# EAGLE schematic C10450-01 (EAGLE 6.6.0)
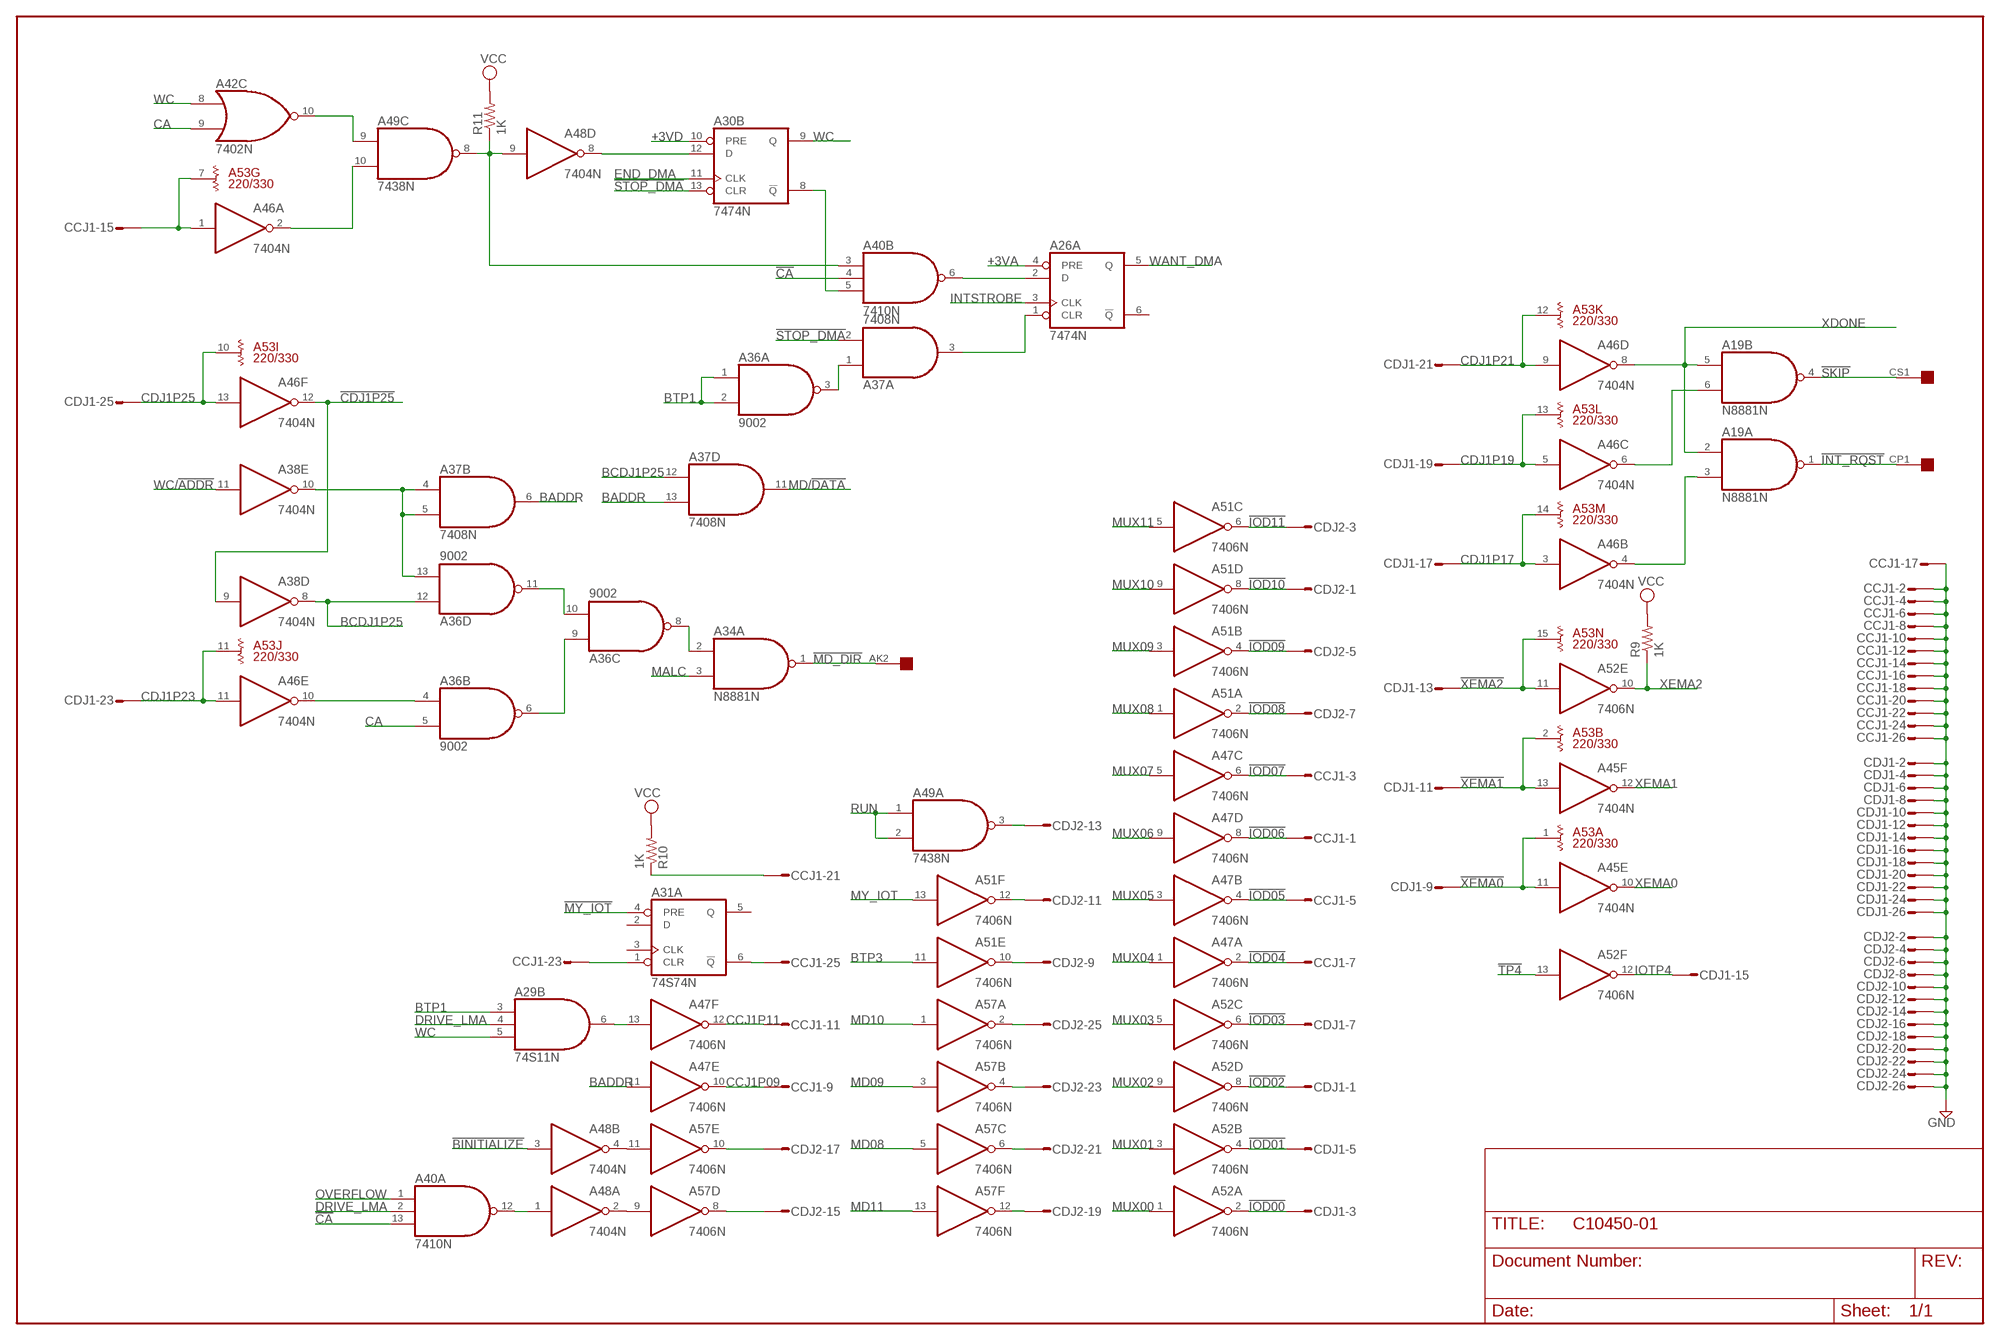
[diagram p0: schematic, sheet 1, part 1 of 3]
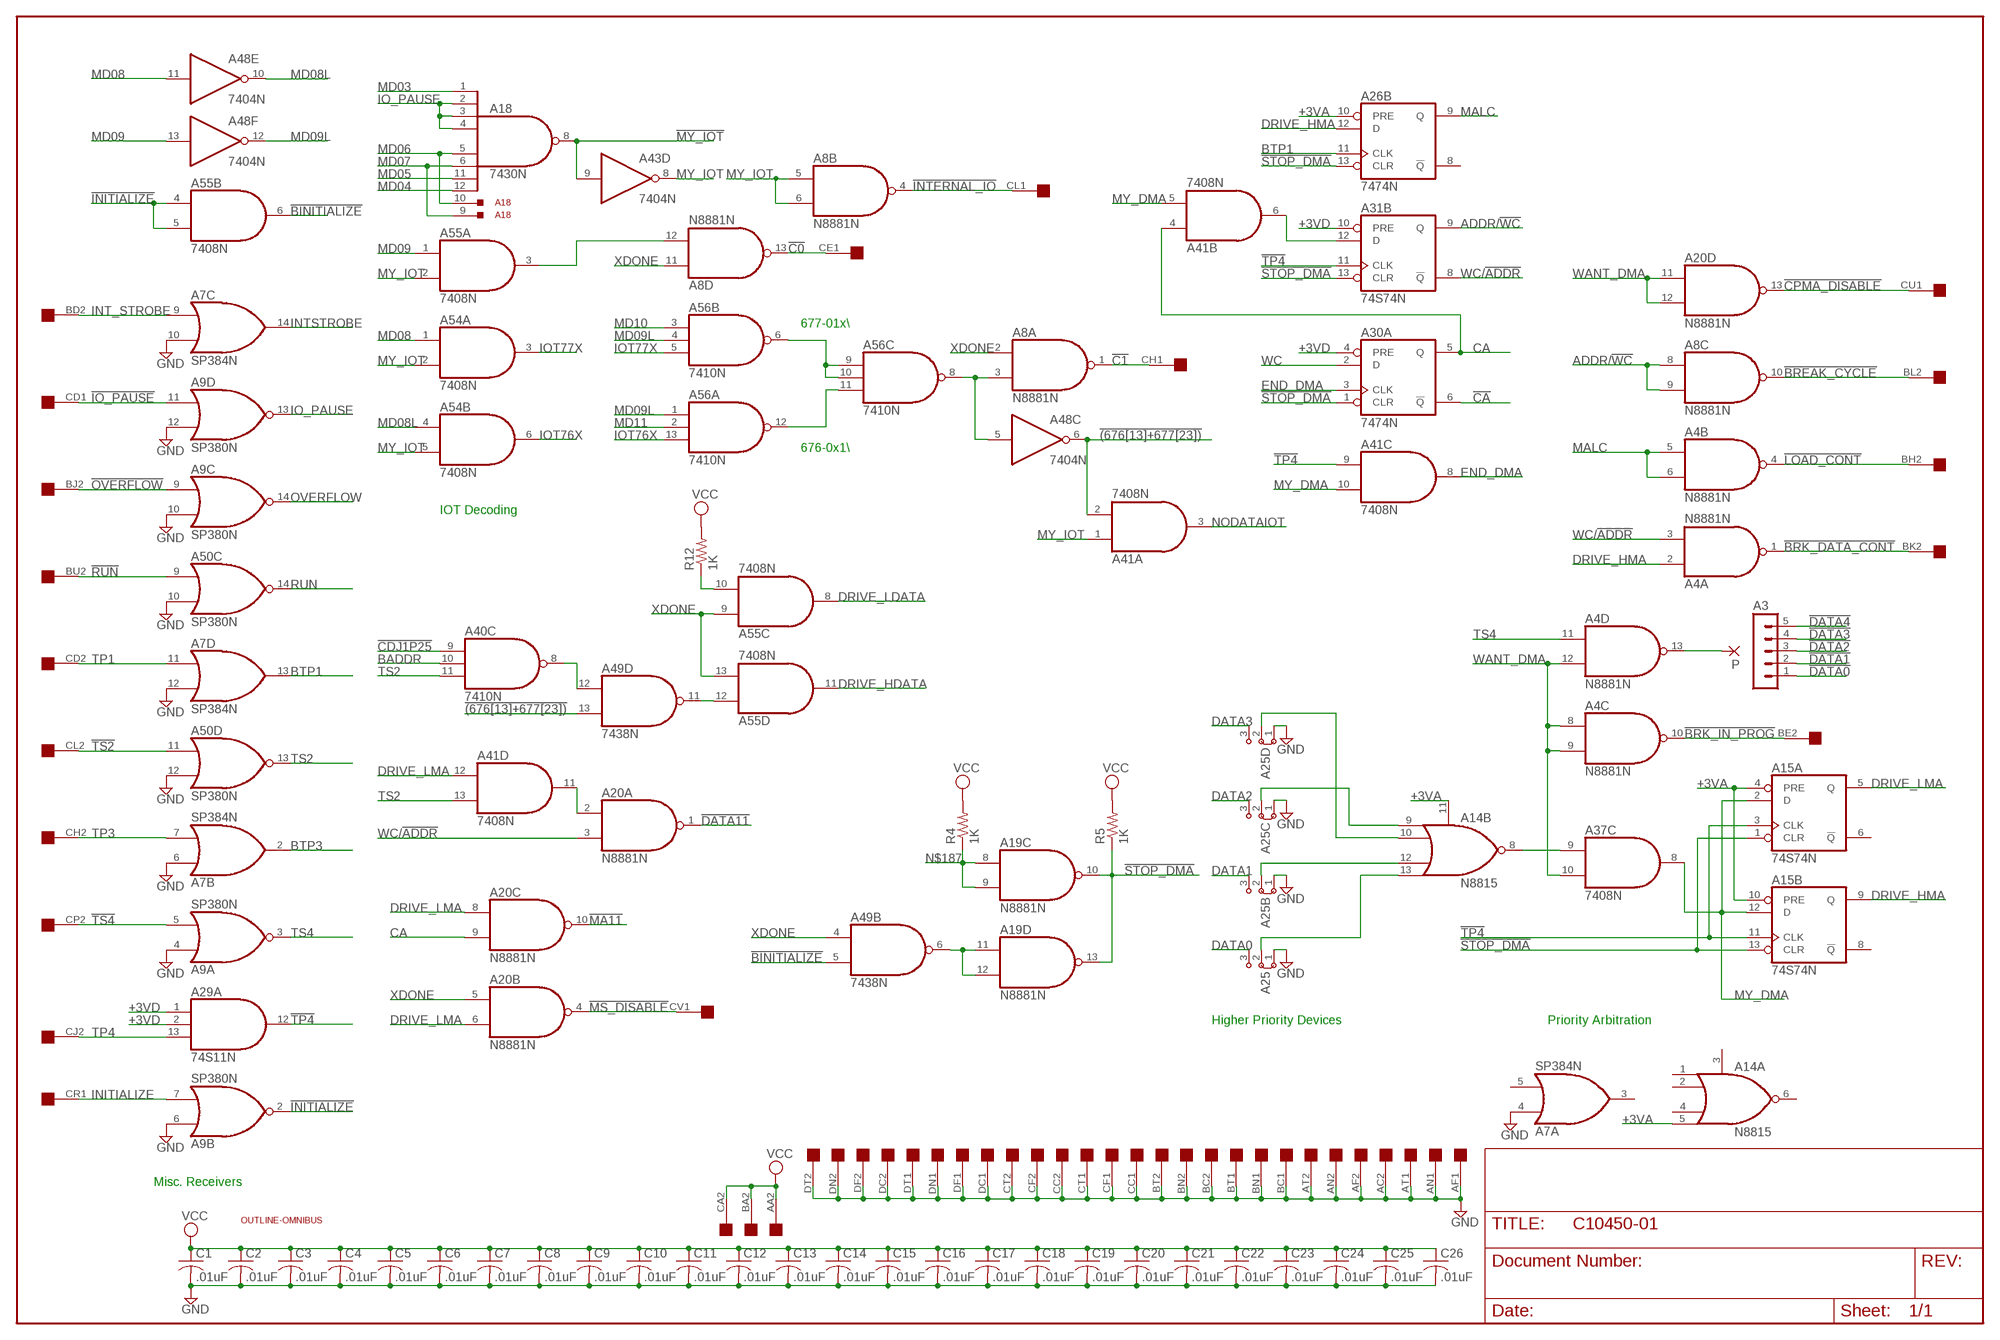
[diagram p1: schematic, sheet 1, part 2 of 3]
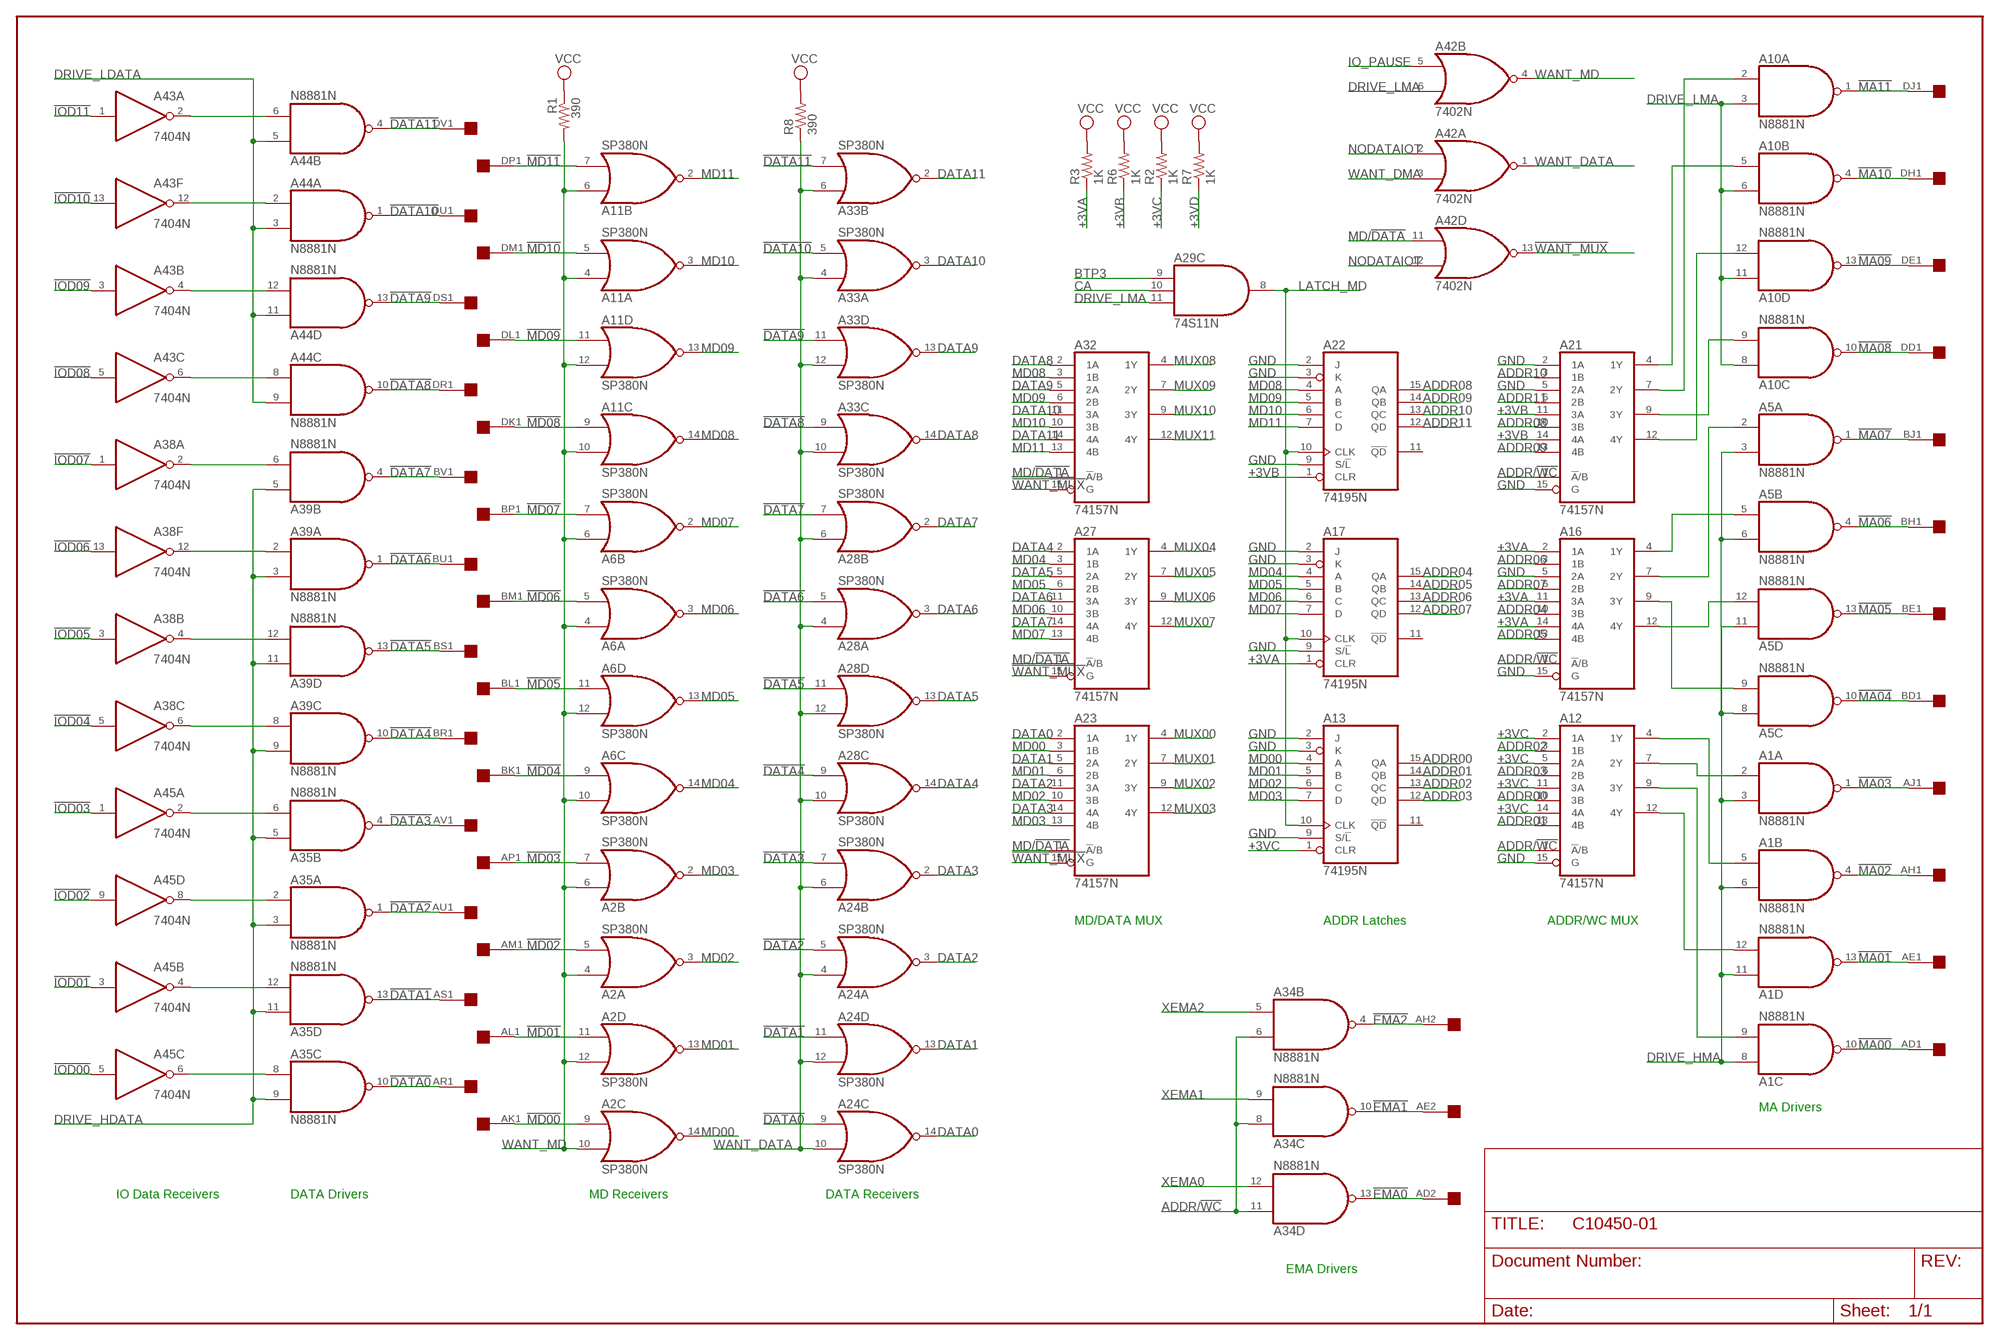
[diagram p2: schematic, sheet 1, part 3 of 3]

## Parts
A1  N8881N  [DIL14]
A2  SP380N  [DIL14]
A3  MA05-1  [MA05-1]
A4  N8881N  [DIL14]
A5  N8881N  [DIL14]
A6  SP380N  [DIL14]
A7  SP384N  [DIL14]
A8  N8881N  [DIL14]
A9  SP380N  [DIL14]
A10  N8881N  [DIL14]
A11  SP380N  [DIL14]
A12  74157N  [DIL16]
A13  74195N  74S195N  [DIL16]
A14  N8815  7425N  [DIL14]
A15  74S74N  [DIL14]
A16  74157N  [DIL16]
A17  74195N  74S195N  [DIL16]
A18  7430N  [DIL14]
A19  N8881N  [DIL14]
A20  N8881N  [DIL14]
A21  74157N  [DIL16]
A22  74195N  74S195N  [DIL16]
A23  74157N  [DIL16]
A24  SP380N  [DIL14]
A25  J2X5MM  [05C]
A25B  J2X5MM  [05C]
A25C  J2X5MM  [05C]
A25D  J2X5MM  [05C]
A26  7474N  74S74N  [DIL14]
A27  74157N  [DIL16]
A28  SP380N  [DIL14]
A29  74S11N  [DIL14]
A30  7474N  74S74N  [DIL14]
A31  74S74N  [DIL14]
A32  74157N  [DIL16]
A33  SP380N  [DIL14]
A34  N8881N  [DIL14]
A35  N8881N  [DIL14]
A36  9002  7400N  [DIL14]
A37  7408N  74LS08N  [DIL14]
A38  7404N  [DIL14]
A39  N8881N  [DIL14]
A40  7410N  [DIL14]
A41  7408N  74LS08N  [DIL14]
A42  7402N  [DIL14]
A43  7404N  [DIL14]
A44  N8881N  [DIL14]
A45  7404N  [DIL14]
A46  7404N  [DIL14]
A47  7406N  [DIL14]
A48  7404N  [DIL14]
A49  7438N  [DIL14]
A50  SP380N  [DIL14]
A51  7406N  [DIL14]
A52  7406N  [DIL14]
A53  220/330  [DIL16]
A54  7408N  74LS08N  [DIL14]
A55  7408N  74LS08N  [DIL14]
A56  7410N  [DIL14]
A57  7406N  [DIL14]
C1  .01uF  C-US050-025X075  [C050-025X075]
C2  .01uF  C-US050-025X075  [C050-025X075]
C3  .01uF  C-US050-025X075  [C050-025X075]
C4  .01uF  C-US050-025X075  [C050-025X075]
C5  .01uF  C-US050-025X075  [C050-025X075]
C6  .01uF  C-US050-025X075  [C050-025X075]
C7  .01uF  C-US050-025X075  [C050-025X075]
C8  .01uF  C-US050-025X075  [C050-025X075]
C9  .01uF  C-US050-025X075  [C050-025X075]
C10  .01uF  C-US050-025X075  [C050-025X075]
C11  .01uF  C-US050-025X075  [C050-025X075]
C12  .01uF  C-US050-025X075  [C050-025X075]
C13  .01uF  C-US050-025X075  [C050-025X075]
C14  .01uF  C-US050-025X075  [C050-025X075]
C15  .01uF  C-US050-025X075  [C050-025X075]
C16  .01uF  C-US050-025X075  [C050-025X075]
C17  .01uF  C-US050-025X075  [C050-025X075]
C18  .01uF  C-US050-025X075  [C050-025X075]
C19  .01uF  C-US050-025X075  [C050-025X075]
C20  .01uF  C-US050-025X075  [C050-025X075]
C21  .01uF  C-US050-025X075  [C050-025X075]
C22  .01uF  C-US050-025X075  [C050-025X075]
C23  .01uF  C-US050-025X075  [C050-025X075]
C24  .01uF  C-US050-025X075  [C050-025X075]
C25  .01uF  C-US050-025X075  [C050-025X075]
C26  .01uF  C-US050-025X075  [C050-025X075]
CCJ1  26HS  [26H]
CDJ1  26HS  [26H]
CDJ2  26HS  [26H]
P  1,6/0,8  [1,6/0,8]
R1  390  R-US_0207/10  [0207/10]
R2  1K  R-US_0207/10  [0207/10]
R3  1K  R-US_0207/10  [0207/10]
R4  1K  R-US_0207/10  [0207/10]
R5  1K  R-US_0207/10  [0207/10]
R6  1K  R-US_0207/10  [0207/10]
R7  1K  R-US_0207/10  [0207/10]
R8  390  R-US_0207/10  [0207/10]
R9  1K  R-US_0207/10  [0207/10]
R10  1K  R-US_0207/10  [0207/10]
R11  1K  R-US_0207/10  [0207/10]
R12  1K  R-US_0207/10  [0207/10]
U$1  OUTLINE-OMNIBUS  [OMNIBUS]
U$2  QUAD  [EDGE-CON8]

## Nets
!(676[13]+677[23]): A41.2(A:I1) A48.6(C:O) A49.13(D:I1)
!BINITIALIZE: A48.3(B:I) A49.5(B:I1) A55.6(B:O)
!BREAK_CYCLE: A8.10(C:O) U$2.BL2
!BRK_DATA_CONT: A4.1(A:O) U$2.BK2
!BRK_IN_PROG: A4.10(C:O) U$2.BE2
!C0: A8.13(D:O) U$2.CE1
!C1: A8.1(A:O) U$2.CH1
!CA: A30.6(A:!Q) A40.4(B:I1) A40.13(A:I2)
!CDJ1P25: A38.9(D:I) A40.9(C:I0) A46.12(F:O)
!CPMA_DISABLE: A20.13(D:O) U$2.CU1
!DATA0: A3.1 A24.9(C:I0) A35.10(C:O) U$2.AR1
!DATA1: A3.2 A24.11(D:I0) A35.13(D:O) U$2.AS1
!DATA2: A3.3 A24.5(A:I1) A35.1(A:O) U$2.AU1
!DATA3: A3.4 A24.7(B:I1) A35.4(B:O) U$2.AV1
!DATA4: A3.5 A28.9(C:I0) A39.10(C:O) U$2.BR1
!DATA5: A28.11(D:I0) A39.13(D:O) U$2.BS1
!DATA6: A28.5(A:I1) A39.1(A:O) U$2.BU1
!DATA7: A28.7(B:I1) A39.4(B:O) U$2.BV1
!DATA8: A33.9(C:I0) A44.10(C:O) U$2.DR1
!DATA9: A33.11(D:I0) A44.13(D:O) U$2.DS1
!DATA10: A33.5(A:I1) A44.1(A:O) U$2.DU1
!DATA11: A20.1(A:O) A33.7(B:I1) A44.4(B:O) U$2.DV1
!EMA0: A34.13(D:O) U$2.AD2
!EMA1: A34.10(C:O) U$2.AE2
!EMA2: A34.4(B:O) U$2.AH2
!INITIALIZE: A9.2(B:O) A55.4(B:I0) A55.5(B:I1)
!INT_RQST: A19.1(A:O) U$2.CP1
!INTERNAL_IO: A8.4(B:O) U$2.CL1
!IO_PAUSE: A9.11(D:I0) U$2.CD1
!IOD00: A45.5(C:I) A52.2(A:O) CDJ1.3
!IOD01: A45.3(B:I) A52.4(B:O) CDJ1.5
!IOD02: A45.9(D:I) A52.8(D:O) CDJ1.1
!IOD03: A45.1(A:I) A52.6(C:O) CDJ1.7
!IOD04: A38.5(C:I) A47.2(A:O) CCJ1.7
!IOD05: A38.3(B:I) A47.4(B:O) CCJ1.5
!IOD06: A38.13(F:I) A47.8(D:O) CCJ1.1
!IOD07: A38.1(A:I) A47.6(C:O) CCJ1.3
!IOD08: A43.5(C:I) A51.2(A:O) CDJ2.7
!IOD09: A43.3(B:I) A51.4(B:O) CDJ2.5
!IOD10: A43.13(F:I) A51.8(D:O) CDJ2.1
!IOD11: A43.1(A:I) A51.6(C:O) CDJ2.3
!LOAD_CONT: A4.4(B:O) U$2.BH2
!MA00: A1.10(C:O) U$2.AD1
!MA01: A1.13(D:O) U$2.AE1
!MA02: A1.4(B:O) U$2.AH1
!MA03: A1.1(A:O) U$2.AJ1
!MA04: A5.10(C:O) U$2.BD1
!MA05: A5.13(D:O) U$2.BE1
!MA06: A5.4(B:O) U$2.BH1
!MA07: A5.1(A:O) U$2.BJ1
!MA08: A10.10(C:O) U$2.DD1
!MA09: A10.13(D:O) U$2.DE1
!MA10: A10.4(B:O) U$2.DH1
!MA11: A10.1(A:O) A20.10(C:O) U$2.DJ1
!MD00: A2.9(C:I0) U$2.AK1
!MD01: A2.11(D:I0) U$2.AL1
!MD02: A2.5(A:I1) U$2.AM1
!MD03: A2.7(B:I1) U$2.AP1
!MD04: A6.9(C:I0) U$2.BK1
!MD05: A6.11(D:I0) U$2.BL1
!MD06: A6.5(A:I1) U$2.BM1
!MD07: A6.7(B:I1) U$2.BP1
!MD08: A11.9(C:I0) U$2.DK1
!MD09: A11.11(D:I0) U$2.DL1
!MD10: A11.5(A:I1) U$2.DM1
!MD11: A11.7(B:I1) U$2.DP1
!MD_DIR: A34.1(A:O) U$2.AK2
!MS_DISABLE: A20.4(B:O) U$2.CV1
!MY_IOT: A18.8(O) A31.4(A:PRE) A43.9(D:I)
!OVERFLOW: A9.9(C:I0) U$2.BJ2
!RUN: A50.9(C:I0) U$2.BU2
!SKIP: A19.4(B:O) U$2.CS1
!STOP_DMA: A15.1(A:CLR) A15.13(B:CLR) A19.10(C:O) A19.13(D:O) A26.13(B:CLR) A30.1(A:CLR) A30.13(B:CLR) A31.13(B:CLR) A37.2(A:I1) R5.1
!TP4: A15.3(A:CLK) A15.11(B:CLK) A29.12(A:O) A31.11(B:CLK) A41.9(C:I0) A52.13(F:I)
!TS2: A50.11(D:I0) U$2.CL2
!TS4: A9.5(A:I1) U$2.CP2
!WANT_MUX: A23.15(G) A27.15(G) A32.15(G) A42.13(D:O)
!WC: A30.8(B:!Q) A40.5(B:I2)
!XEMA0: A45.11(E:I) A53.1(A:TERM) CDJ1.9
!XEMA1: A45.13(F:I) A53.2(B:TERM) CDJ1.11
!XEMA2: A52.11(E:I) A53.15(N:TERM) CDJ1.13
+3VA: A14.5(A:I3) A14.11(B:G) A15.4(A:PRE) A15.10(B:PRE) A16.2(1A) A16.11(3A) A16.14(4A) A17.1(CLR) A26.4(A:PRE) A26.10(B:PRE) R3.1
+3VB: A21.11(3A) A21.14(4A) A22.1(CLR) R6.1
+3VC: A12.2(1A) A12.5(2A) A12.11(3A) A12.14(4A) A13.1(CLR) R2.1
+3VD: A29.1(A:I0) A29.2(A:I1) A30.4(A:PRE) A30.10(B:PRE) A31.10(B:PRE) R7.1
ADDR00: A12.10(3B) A13.15(QA)
ADDR01: A12.13(4B) A13.14(QB)
ADDR02: A12.3(1B) A13.13(QC)
ADDR03: A12.6(2B) A13.12(QD)
ADDR04: A16.10(3B) A17.15(QA)
ADDR05: A16.13(4B) A17.14(QB)
ADDR06: A16.3(1B) A17.13(QC)
ADDR07: A16.6(2B) A17.12(QD)
ADDR08: A21.10(3B) A22.15(QA)
ADDR09: A21.13(4B) A22.14(QB)
ADDR10: A21.3(1B) A22.13(QC)
ADDR11: A21.6(2B) A22.12(QD)
ADDR/!WC: A8.8(C:I0) A8.9(C:I1) A12.1(!A!/B) A16.1(!A!/B) A21.1(!A!/B) A31.9(B:Q) A34.6(B:I1) A34.8(C:I0) A34.11(D:I0)
BADDR: A37.6(B:O) A37.13(D:I1) A40.10(C:I1) A47.11(E:I)
BCDJ1P25: A36.12(D:I0) A37.12(D:I0) A38.8(D:O)
BTP1: A7.13(D:O) A26.11(B:CLK) A29.3(B:I0) A36.1(A:I0) A36.2(A:I1)
BTP3: A7.2(B:O) A29.9(C:I0) A51.11(E:I)
CA: A20.9(C:I1) A29.10(C:I1) A30.5(A:Q) A36.5(B:I1) A41.4(B:I0) A42.9(C:I1)
CCJ1P09: A47.10(E:O) CCJ1.9
CCJ1P11: A47.12(F:O) CCJ1.11
CDJ1P17: A46.3(B:I) A53.14(M:TERM) CDJ1.17
CDJ1P19: A46.5(C:I) A53.13(L:TERM) CDJ1.19
CDJ1P21: A46.9(D:I) A53.12(K:TERM) CDJ1.21
CDJ1P23: A46.11(E:I) A53.11(J:TERM) CDJ1.23
CDJ1P25: A46.13(F:I) A53.10(I:TERM) CDJ1.25
CDJ2P09: A51.10(E:O) CDJ2.9
CDJ2P11: A51.12(F:O) CDJ2.11
CDJ2P13: A49.3(A:O) CDJ2.13
CDJ2P15: A57.8(D:O) CDJ2.15
CDJ2P17: A57.10(E:O) CDJ2.17
CDJ2P19: A57.12(F:O) CDJ2.19
CDJ2P21: A57.6(C:O) CDJ2.21
CDJ2P23: A57.4(B:O) CDJ2.23
CDJ2P25: A57.2(A:O) CDJ2.25
DATA0: A23.2(1A) A24.14(C:O) A25.3
DATA1: A23.5(2A) A24.13(D:O) A25B.3
DATA2: A23.11(3A) A24.3(A:O) A25C.3
DATA3: A23.14(4A) A24.2(B:O) A25D.3
DATA4: A27.2(1A) A28.14(C:O)
DATA5: A27.5(2A) A28.13(D:O)
DATA6: A27.11(3A) A28.3(A:O)
DATA7: A27.14(4A) A28.2(B:O)
DATA8: A32.2(1A) A33.14(C:O)
DATA9: A32.5(2A) A33.13(D:O)
DATA10: A32.11(3A) A33.3(A:O)
DATA11: A32.14(4A) A33.2(B:O)
DRIVE_HDATA: A35.3(A:I1) A35.5(B:I0) A35.9(C:I1) A35.11(D:I0) A39.3(A:I1) A39.5(B:I0) A39.9(C:I1) A39.11(D:I0) A55.11(D:O)
DRIVE_HMA: A1.3(A:I1) A1.6(B:I1) A1.8(C:I0) A1.11(D:I0) A4.2(A:I0) A5.3(A:I1) A5.6(B:I1) A5.8(C:I0) A5.11(D:I0) A15.9(B:Q) A26.12(B:D)
DRIVE_LDATA: A44.3(A:I1) A44.5(B:I0) A44.9(C:I1) A44.11(D:I0) A55.8(C:O)
DRIVE_LMA: A10.3(A:I1) A10.6(B:I1) A10.8(C:I0) A10.11(D:I0) A15.5(A:Q) A20.6(B:I1) A20.8(C:I0) A29.4(B:I1) A29.11(C:I2) A40.2(A:I1) A41.12(D:I0) A42.6(B:I1)
END_DMA: A30.3(A:CLK) A30.11(B:CLK) A41.8(C:O)
GND [supply]: A7.4(A:I0) A7.6(B:I0) A7.10(C:I1) A7.12(D:I1) A9.4(A:I0) A9.6(B:I0) A9.10(C:I1) A9.12(D:I1) A12.15(G) A13.2(J) A13.3(K) A13.9(S/!L) A16.5(2A) A16.15(G) A17.2(J) A17.3(K) A17.9(S/!L) A21.2(1A) A21.5(2A) A21.15(G) A22.2(J) A22.3(K) A22.9(S/!L) A25.1 A25B.1 A25C.1 A25D.1 A50.10(C:I1) A50.12(D:I1) C1.2 C2.2 C3.2 C4.2 C5.2 C6.2 C7.2 C8.2 C9.2 C10.2 C11.2 C12.2 C13.2 C14.2 C15.2 C16.2 C17.2 C18.2 C19.2 C20.2 C21.2 C22.2 C23.2 C24.2 C25.2 C26.2 CCJ1.2 CCJ1.4 CCJ1.6 CCJ1.8 CCJ1.10 CCJ1.12 CCJ1.14 CCJ1.16 CCJ1.17 CCJ1.18 CCJ1.20 CCJ1.22 CCJ1.24 CCJ1.26 CDJ1.2 CDJ1.4 CDJ1.6 CDJ1.8 CDJ1.10 CDJ1.12 CDJ1.14 CDJ1.16 CDJ1.18 CDJ1.20 CDJ1.22 CDJ1.24 CDJ1.26 CDJ2.2 CDJ2.4 CDJ2.6 CDJ2.8 CDJ2.10 CDJ2.12 CDJ2.14 CDJ2.16 CDJ2.18 CDJ2.20 CDJ2.22 CDJ2.24 CDJ2.26 U$2.AC2 U$2.AF1 U$2.AF2 U$2.AN1 U$2.AN2 U$2.AT1 U$2.AT2 U$2.BC1 U$2.BC2 U$2.BN1 U$2.BN2 U$2.BT1 U$2.BT2 U$2.CC1 U$2.CC2 U$2.CF1 U$2.CF2 U$2.CT1 U$2.CT2 U$2.DC1 U$2.DC2 U$2.DF1 U$2.DF2 U$2.DN1 U$2.DN2 U$2.DT1 U$2.DT2
INITIALIZE: A9.7(B:I1) U$2.CR1
INT_STROBE: A7.9(C:I0) U$2.BD2
INTSTROBE: A7.14(C:O) A26.3(A:CLK)
IO_PAUSE: A9.13(D:O) A18.2(I1) A18.3(I2) A18.4(I3) A42.5(B:I0)
IOT76X: A54.6(B:O) A56.13(A:I2)
IOT77X: A54.3(A:O) A56.5(B:I2)
IOTP4: A52.12(F:O) CDJ1.15
LATCH_MD: A13.10(CLK) A17.10(CLK) A22.10(CLK) A29.8(C:O)
MALC: A4.5(B:I0) A4.6(B:I1) A26.9(B:Q) A34.3(A:I1)
MD00: A2.14(C:O) A13.4(A) A23.3(1B)
MD01: A2.13(D:O) A13.5(B) A23.6(2B)
MD02: A2.3(A:O) A13.6(C) A23.10(3B)
MD03: A2.2(B:O) A13.7(D) A18.1(I0) A23.13(4B)
MD04: A6.14(C:O) A17.4(A) A18.12(I7) A27.3(1B)
MD05: A6.13(D:O) A17.5(B) A18.11(I6) A27.6(2B)
MD06: A6.3(A:O) A17.6(C) A18.5(I4) A18.10 A27.10(3B)
MD07: A6.2(B:O) A17.7(D) A18.6(I5) A18.9 A27.13(4B)
MD08: A11.14(C:O) A22.4(A) A32.3(1B) A48.11(E:I) A54.1(A:I0) A57.5(C:I)
MD08L: A48.10(E:O) A54.4(B:I0)
MD09: A11.13(D:O) A22.5(B) A32.6(2B) A48.13(F:I) A55.1(A:I0) A57.3(B:I)
MD09L: A48.12(F:O) A56.1(A:I0) A56.4(B:I1)
MD10: A11.3(A:O) A22.6(C) A32.10(3B) A56.3(B:I0) A57.1(A:I)
MD11: A11.2(B:O) A22.7(D) A32.13(4B) A56.2(A:I1) A57.13(F:I)
MD/!DATA: A23.1(!A!/B) A27.1(!A!/B) A32.1(!A!/B) A37.11(D:O) A42.11(D:I0)
MUX00: A23.4(1Y) A52.1(A:I)
MUX01: A23.7(2Y) A52.3(B:I)
MUX02: A23.9(3Y) A52.9(D:I)
MUX03: A23.12(4Y) A52.5(C:I)
MUX04: A27.4(1Y) A47.1(A:I)
MUX05: A27.7(2Y) A47.3(B:I)
MUX06: A27.9(3Y) A47.9(D:I)
MUX07: A27.12(4Y) A47.5(C:I)
MUX08: A32.4(1Y) A51.1(A:I)
MUX09: A32.7(2Y) A51.3(B:I)
MUX10: A32.9(3Y) A51.9(D:I)
MUX11: A32.12(4Y) A51.5(C:I)
MY_DMA: A15.2(A:D) A15.12(B:D) A37.8(C:O) A41.5(B:I1) A41.10(C:I1)
MY_IOT: A8.5(B:I0) A8.6(B:I1) A41.1(A:I0) A43.8(D:O) A51.13(F:I) A54.2(A:I1) A54.5(B:I1) A55.2(A:I1)
N$2: A1.9(C:I1) A12.9(3Y)
N$5: A1.12(D:I1) A12.12(4Y)
N$6: A36.6(B:O) A36.9(C:I0)
N$7: A1.5(B:I0) A12.4(1Y)
N$8: A56.6(B:O) A56.9(C:I0) A56.10(C:I1)
N$10: A1.2(A:I0) A12.7(2Y)
N$11: A8.3(A:I1) A48.5(C:I) A56.8(C:O)
N$12: A14.10(B:I1) A25D.2
N$13: A36.4(B:I0) A46.10(E:O)
N$15: A42.10(C:O) A49.9(C:I0)
N$16: A10.5(B:I0) A21.4(1Y)
N$17: A10.2(A:I0) A21.7(2Y)
N$21: A14.8(B:O) A37.9(C:I0)
N$34: A31.1(A:CLR) CCJ1.23
N$39: A4.13(D:O) P.1(P)
N$40: A26.1(A:CLR) A37.3(A:O)
N$52: A26.2(A:D) A40.6(B:O)
N$59: A5.12(D:I1) A16.12(4Y)
N$62: A5.9(C:I1) A16.9(3Y)
N$67: A5.2(A:I0) A16.7(2Y)
N$69: A46.2(A:O) A49.10(C:I1)
N$71: A49.11(D:O) A55.12(D:I0)
N$72: A29.6(B:O) A47.13(F:I)
N$79: A8.12(D:I1) A55.3(A:O)
N$96: A40.12(A:O) A48.1(A:I)
N$119: A10.12(D:I1) A21.12(4Y)
N$122: A10.9(C:I1) A21.9(3Y)
N$131: A5.5(B:I0) A16.4(1Y)
N$156: A31.6(A:!Q) CCJ1.25
N$159: CCJ1.21 R10.1
N$164: A46.1(A:I) A53.7(G:TERM) CCJ1.15
N$187: A19.8(C:I0) A19.9(C:I1) R4.1
N$201: A40.3(B:I0) A48.9(D:I) A49.8(C:O) R11.1
N$214: A19.3(A:I1) A46.4(B:O)
N$226: A19.11(D:I0) A19.12(D:I1) A49.6(B:O)
N$232: A14.13(B:I3) A25.2
N$236: A14.9(B:I0) A25C.2
N$237: A14.12(B:I2) A25B.2
N$246: A43.2(A:O) A44.6(B:I1)
N$265: A48.2(A:O) A57.9(D:I)
N$270: A31.12(B:D) A41.6(B:O)
N$279: A40.8(C:O) A49.12(D:I0)
N$286: A30.12(B:D) A48.8(D:O)
N$287: A38.2(A:O) A39.6(B:I1)
N$295: A19.6(B:I1) A46.6(C:O)
N$309: A20.2(A:I0) A41.11(D:O)
N$472: A34.2(A:I0) A36.8(C:O)
N$476: A35.12(D:I1) A45.4(B:O)
N$478: A35.8(C:I0) A45.6(C:O)
N$482: A35.6(B:I1) A45.2(A:O)
N$484: A35.2(A:I0) A45.8(D:O)
N$488: A36.13(D:I1) A37.4(B:I0) A37.5(B:I1) A38.10(E:O)
N$489: A36.10(C:I1) A36.11(D:O)
N$498: A36.3(A:O) A37.1(A:I0)
N$518: A38.6(C:O) A39.8(C:I0)
N$520: A38.4(B:O) A39.12(D:I1)
N$522: A38.12(F:O) A39.2(A:I0)
N$578: A43.6(C:O) A44.8(C:I0)
N$580: A43.4(B:O) A44.12(D:I1)
N$582: A43.12(F:O) A44.2(A:I0)
N$599: A55.10(C:I1) R12.1
N$645: A48.4(B:O) A57.11(E:I)
N$674: A56.11(C:I2) A56.12(A:O)
NODATAIOT: A41.3(A:O) A42.2(A:I0) A42.12(D:I1)
OVERFLOW: A9.14(C:O) A40.1(A:I0)
RUN: A49.1(A:I0) A49.2(A:I1) A50.14(C:O)
TP1: A7.11(D:I0) U$2.CD2
TP3: A7.7(B:I1) U$2.CH2
TP4: A29.13(A:I2) U$2.CJ2
TS2: A40.11(C:I2) A41.13(D:I1) A50.13(D:O)
TS4: A4.11(D:I0) A9.3(A:O)
VCC [supply]: C1.1 C2.1 C3.1 C4.1 C5.1 C6.1 C7.1 C8.1 C9.1 C10.1 C11.1 C12.1 C13.1 C14.1 C15.1 C16.1 C17.1 C18.1 C19.1 C20.1 C21.1 C22.1 C23.1 C24.1 C25.1 C26.1 R1.1 R2.2 R3.2 R4.2 R5.2 R6.2 R7.2 R8.2 R9.2 R10.2 R11.2 R12.2 U$2.AA2 U$2.BA2 U$2.CA2
WANT_DATA: A24.4(A:I0) A24.6(B:I0) A24.10(C:I1) A24.12(D:I1) A28.4(A:I0) A28.6(B:I0) A28.10(C:I1) A28.12(D:I1) A33.4(A:I0) A33.6(B:I0) A33.10(C:I1) A33.12(D:I1) A42.1(A:O) R8.1
WANT_DMA: A4.8(C:I0) A4.9(C:I1) A4.12(D:I1) A20.11(D:I0) A20.12(D:I1) A26.5(A:Q) A37.10(C:I1) A42.3(A:I1)
WANT_MD: A2.4(A:I0) A2.6(B:I0) A2.10(C:I1) A2.12(D:I1) A6.4(A:I0) A6.6(B:I0) A6.10(C:I1) A6.12(D:I1) A11.4(A:I0) A11.6(B:I0) A11.10(C:I1) A11.12(D:I1) A42.4(B:O) R1.2
WC: A29.5(B:I2) A30.2(A:D) A30.9(B:Q) A42.8(C:I0)
WC/!ADDR: A4.3(A:I1) A20.3(A:I1) A31.8(B:!Q) A38.11(E:I)
XDONE: A8.2(A:I0) A8.11(D:I0) A19.2(A:I0) A19.5(B:I0) A20.5(B:I0) A46.8(D:O) A49.4(B:I0) A55.9(C:I0) A55.13(D:I1)
XEMA0: A34.12(D:I1) A45.10(E:O)
XEMA1: A34.9(C:I1) A45.12(F:O)
XEMA2: A34.5(B:I0) A52.10(E:O) R9.1
Unconnected: A7.3(A:O) A7.5(A:I1) A13.11(!QD) A14.1(A:I0) A14.2(A:I1) A14.3(A:G) A14.4(A:I2) A14.6(A:O) A15.6(A:!Q) A15.8(B:!Q) A17.11(!QD) A18.13 A22.11(!QD) A26.6(A:!Q) A26.8(B:!Q) A31.2(A:D) A31.3(A:CLK) A31.5(A:Q) A43.10(E:O) A43.11(E:I) A50.2(B:O) A50.3(A:O) A50.4(A:I0) A50.5(A:I1) A50.6(B:I0) A50.7(B:I1) A53.3(C:TERM) A53.4(D:TERM) A53.5(E:TERM) A53.6(F:TERM) A53.9(H:TERM) A54.8(C:O) A54.9(C:I0) A54.10(C:I1) A54.11(D:O) A54.12(D:I0) A54.13(D:I1) CCJ1.13 CCJ1.19 U$2.AA1 U$2.AB1 U$2.AB2 U$2.AC1 U$2.AJ2 U$2.AL2 U$2.AM2 U$2.AP2 U$2.AR2 U$2.AS2 U$2.AU2 U$2.AV2 U$2.BA1 U$2.BB1 U$2.BB2 U$2.BF1 U$2.BF2 U$2.BM2 U$2.BP2 U$2.BR2 U$2.BS2 U$2.BV2 U$2.CA1 U$2.CB1 U$2.CB2 U$2.CE2 U$2.CJ1 U$2.CK1 U$2.CK2 U$2.CM1 U$2.CM2 U$2.CN1 U$2.CN2 U$2.CR2 U$2.CS2 U$2.CU2 U$2.CV2 U$2.DA1 U$2.DA2 U$2.DB1 U$2.DB2 U$2.DD2 U$2.DE2 U$2.DH2 U$2.DJ2 U$2.DK2 U$2.DL2 U$2.DM2 U$2.DP2 U$2.DR2 U$2.DS2 U$2.DU2 U$2.DV2

## Notes on the sheet
- 677-01x\\
- 676-0x1\\
- IOT Decoding
- MD/DATA MUX | ADDR Latches | ADDR/WC MUX
- Higher Priority Devices | Priority Arbitration
- MA Drivers
- Misc. Receivers
- IO Data Receivers | DATA Drivers | MD Receivers | DATA Receivers
- EMA Drivers

## Power pins joined to a net without a drawn wire
GND: A1.7(P:GND) A2.1(P:GND) A4.7(P:GND) A5.7(P:GND) A6.1(P:GND) A7.1(GND) A8.7(P:GND) A9.1(P:GND) A10.7(P:GND) A11.1(P:GND) A12.8(GND) A13.8(GND) A14.7(P:GND) A15.7(P:GND) A16.8(GND) A17.8(GND) A18.7(GND) A19.7(P:GND) A20.7(P:GND) A21.8(GND) A22.8(GND) A23.8(GND) A24.1(P:GND) A26.7(P:GND) A27.8(GND) A28.1(P:GND) A29.7(P:GND) A30.7(P:GND) A31.7(P:GND) A32.8(GND) A33.1(P:GND) A34.7(P:GND) A35.7(P:GND) A36.7(P:GND) A37.7(P:GND) A38.7(P:GND) A39.7(P:GND) A40.7(P:GND) A41.7(P:GND) A42.7(P:GND) A43.7(P:GND) A44.7(P:GND) A45.7(P:GND) A46.7(P:GND) A47.7(P:GND) A48.7(P:GND) A49.7(P:GND) A50.1(P:GND) A51.7(P:GND) A52.7(P:GND) A53.8(PWR:GND) A54.7(P:GND) A55.7(P:GND) A56.7(P:GND) A57.7(P:GND)
VCC: A1.14(P:VCC) A2.8(P:VCC) A4.14(P:VCC) A5.14(P:VCC) A6.8(P:VCC) A7.8(VCC) A8.14(P:VCC) A9.8(P:VCC) A10.14(P:VCC) A11.8(P:VCC) A12.16(VCC) A13.16(VCC) A14.14(P:VCC) A15.14(P:VCC) A16.16(VCC) A17.16(VCC) A18.14(VCC) A19.14(P:VCC) A20.14(P:VCC) A21.16(VCC) A22.16(VCC) A23.16(VCC) A24.8(P:VCC) A26.14(P:VCC) A27.16(VCC) A28.8(P:VCC) A29.14(P:VCC) A30.14(P:VCC) A31.14(P:VCC) A32.16(VCC) A33.8(P:VCC) A34.14(P:VCC) A35.14(P:VCC) A36.14(P:VCC) A37.14(P:VCC) A38.14(P:VCC) A39.14(P:VCC) A40.14(P:VCC) A41.14(P:VCC) A42.14(P:VCC) A43.14(P:VCC) A44.14(P:VCC) A45.14(P:VCC) A46.14(P:VCC) A47.14(P:VCC) A48.14(P:VCC) A49.14(P:VCC) A50.8(P:VCC) A51.14(P:VCC) A52.14(P:VCC) A53.16(PWR:VCC) A54.14(P:VCC) A55.14(P:VCC) A56.14(P:VCC) A57.14(P:VCC)

## Library data of the parts
A1 A4 A5 A8 A10 A19 A20 A34 A35 A39 A44 = dec-con:N8881: Quad 2-input NAND gate, open collector
A2 A6 A9 A11 A24 A28 A33 A50 = dec-con:SP380: Quad NOR gate (use 8640)
A3 = con-lstb:MA05-1: PIN HEADER; OC_FARNELL: unknown; OC_NEWARK: unknown
A7 = dec-con:SP384: Quad OR gate
A12 A16 A21 A23 A27 A32 = 74xx-us:74*157: Quadruple 2-line to 1-line data SELECTOR/MULTIPLEXER
A13 A17 A22 = 74xx-us:74*195: 4-bit parallel access SHIFT REGISTER
A14 = 74xx-us:74*25: Dual 4-input NOR gate, strobe
A15 A26 A30 A31 = 74xx-us:74*74: Dual D type positive edge triggered FLIP FLOP, preset and clear
A18 = dec-con:74*30: 8-input NAND gate
A25 A25B A25C A25D = jumper:J2: Jumper switch 2 x 2.5 mm
A29 = 74xx-us:74*11: Triple 3-input AND gate
A36 = 74xx-us:74*00: Quad 2-input NAND gate
A37 A41 A54 A55 = 74xx-us:74*08: Quad 2-input AND gate
A38 A43 A45 A46 A48 = 74xx-us:74*04: Hex INVERTER
A40 A56 = 74xx-us:74*10: Triple 3-input NAND gate
A42 = 74xx-us:74*02: Quad 2-input NOR gate
A47 A51 A52 A57 = 74xx-us:74*06: Hex INVERTER, open collector high-voltage output
A49 = dec-con:74*38: Quad 2-input NAND gate, open collector output
A53 = dec-con:220/330: Resistor Terminator Pack
C1-C26 = rcl:C-US: CAPACITOR, American symbol
CCJ1 CDJ1 CDJ2 = con-harting-h:26HS: CONNECTOR; OC_FARNELL: unknown; OC_NEWARK: unknown
P = wirepad:1,6/0,8: THROUGH-HOLE PAD
R1-R12 = rcl:R-US_: RESISTOR, American symbol
U$1 = dec-con:OUTLINE-*: Board outlines for DEC boards.
U$2 = dec-con:QUAD: Quad-Height DEC board

## Net classes
1 supply: width 0.813 mm